# Altium schematic sheet 电源ARM_VRD240512MP-8W.SchDoc
size A4; DocumentNumber: 11; SheetNumber: 11; SheetTotal: 34
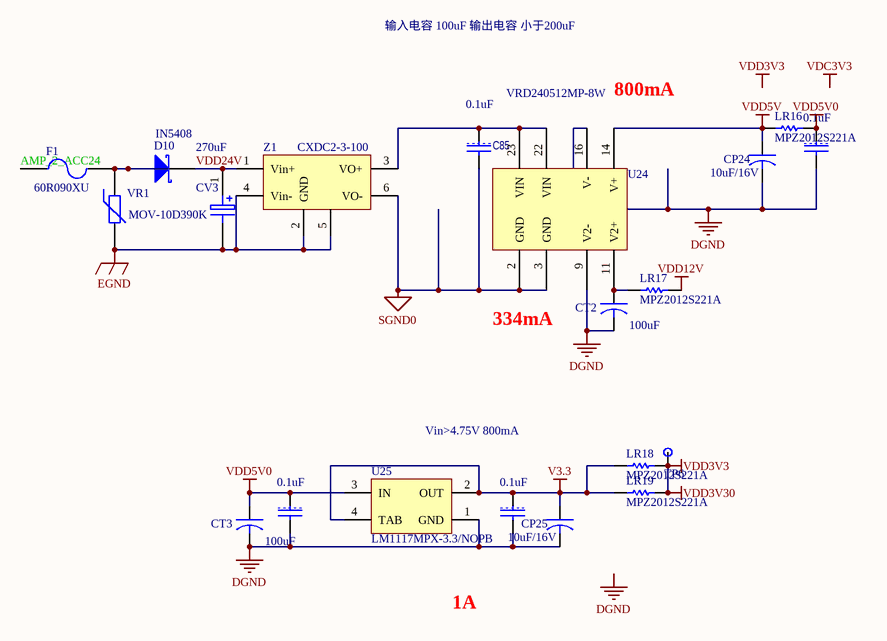
[diagram p0: 电源ARM_VRD240512MP-8W.SchDoc]

## Parts
C85  value 0.1uF  [1608[0603]C]  (hidden comment: C1608X7R1H104K)
C86  value 0.1uF  [1608[0603]C]  (hidden comment: C1608X7R1H104K)
C87  value 0.1uF  [1608[0603]C]  (hidden comment: C1608X7R1H104K)
C88  value 0.1uF  [1608[0603]C]  (hidden comment: C1608X7R1H104K)
CP24  10uF/16V  [3216[1206]CB]
CP25  10uF/16V  [3216[1206]CB]
CT2  value 100uF  [6032[2312]CC]  (hidden comment: TAJC107K016RNJ)
CT3  value 100uF  [6032[2312]CC]  (hidden comment: TAJC107K016RNJ)
CV3  value 270uF  [CAPPR5-10x20/H1.1]  (hidden comment: EEU-FM1H271)
D10  IN5408  [DO-214AB/SMC]
F1  60R090XU  [FUS-0.2]
LR16  MPZ2012S221A  [2012[0805]]
LR17  MPZ2012S221A  [2012[0805]]
LR18  MPZ2012S221A  [2012[0805]]
LR19  MPZ2012S221A  [2012[0805]]
TP6  TP  [TP]  (value not drawn)
U24  VRD240512MP-8W  [DIP-7(24)W]
U25  LM1117MPX-3.3/NOPB  [MP04A_N]
VR1  MOV-10D390K  [RAD-0.3]
Z1  CXDC2-3-100  [DIP-6(20)W]

## Nets
DGND: C86.2 C87.2 C88.2 CP24.2 CP25.2 CT2.2 CT3.2 U24.9(V2-) U24.16(V-) U25.1(GND)
EGND: CV3.2 VR1.2 Z1.2(GND) Z1.4(Vin-) Z1.5(GND)
SGND0: C85.2 U24.2(GND) U24.3(GND) Z1.6(VO-)
V3.3: C88.1 CP25.1 LR18.1 LR19.1 U25.2(OUT) U25.4(TAB)
VDD3V3: LR18.2 LR19.2 TP6.1(TestPoint)  [also labelled VDD3V30]
VDD5V: CP24.1 LR16.1 U24.14(V+)
VDD5V0: C86.1 C87.1 CT3.1 LR16.2 U25.3(IN)
VDD12V: LR17.2
AMP_2_ACC24: F1.1
VDD24V: CV3.1 D10.2(K) Z1.1(Vin+)
NetC85_1: C85.1 U24.22(VIN) U24.23(VIN) Z1.3(VO+)
NetCT2_1: CT2.1 LR17.1 U24.11(V2+)
NetD10_1: D10.1(A) F1.2 VR1.1

## Notes on the sheet
- 输入电容 100uF 输出电容 小于200uF
- 800mA
- 334mA
- Vin>4.75V 800mA
- 1A
- Labels drawn without touching a wire or pin: DGND, VDC3V3, VDD3V3

## Library data of the parts
C85-C88 = CAP: 多层陶瓷电容器MLCC - SMD/SMT 0603 0.1uF 50volts X7R 10%; Manufacturer: TDK; 产品: General Type MLCCs; 产品种类: Low & Medium Capacitance SMD Ceramic Chip Capacitors; 外壳代码 - in: 0603; 外壳代码 - mm: 1608; 封装 / 箱体: 0603 (1608 metric); 封装: Reel; 尺寸: 0.8 mm W x 1.6 mm L x 0.8 mm H; 工作温度范围: - 55 C to + 125 C; 标准包装数量: 4000; 电压额定值: 50 V; 电容-nF: 100 nF; 电容-pF: 100000 pF; 系列: C; Supplier 1: Mouser; Supplier Part Number 1: 810-C1608X7R1H104K; Manufacturer Part Number: C1608X7R1H104K; RoHS: RoHS Compliant; Description 1: 多层陶瓷电容器MLCC - SMD/SMT 0603 0.1uF 50volts X7R 10%; Category: 多层陶瓷电容器MLCC - SMD/SMT; Stock 1: 224604; Pricing 1: 1=0.160, 50=0.070, 100=0.036, 500=0.019, 1000=0.013, 4000=0.010, 8000=0.009, 12000=0.008, 20000=0.007 (USD); ComponentLink1URL: http://www.tdk.com/pdf/general_B11.pdf; ComponentLink1Description: http://www.tdk.com/pdf/general_B11.pdf; Minimum Order Quantity: 1; Reeling: True; RoHS - 贸泽: Y; 制造商: TDK; 容差: 10 %; 温度系数/代码: X7R; 电容: 0.1 uF; 端接类型: SMD/SMT
CP24 CP25 = CAPACITOR: Tantalum Capacitor; Compy: TAJ; name: TAJ-A-106-M-010-R
CT2 CT3 = CAPACITOR: 钽质电容器-固体SMD 16V 100uF 10%; Manufacturer: AVX; 尺寸: 3.2 mm W x 6 mm L; 高度: 2.8 mm; 工作温度范围: - 55 C to + 125 C; 封装 / 箱体: 2412 (6032 metric); 封装: Reel; 产品: Tantalum Solid Standard Grade - Other Various; 系列: TAJ; 端接类型: SMD/SMT; ESR: 1 Ohms; 漏泄电流: 16 uA; 外壳代码 - in: 2412; 外壳代码 - mm: 6032; 损耗因数 DF: 8; 制造商库存号: C Case; 产品种类: SMD Tantalum Capacitors; 标准包装数量: 500; Supplier 1: Mouser; Supplier Part Number 1: 581-TAJC107K016RNJ; Manufacturer Part Number: TAJC107K016RNJ; RoHS: RoHS Compliant; Description 1: 钽质电容器-固体SMD 16V 100uF 10%; Category: 钽质电容器-固体SMD; Stock 1: 40; Pricing 1: 1=1.50, 50=0.930, 100=0.720, 500=0.540, 1000=0.480 (USD); 电容: 100 uF; 容差: 10 %; 电压额定值: 16 V; 制造商: AVX; RoHS - 贸泽: Y; Minimum Order Quantity: 1; Reeling: True; ComponentLink1URL: http://www.avx.com/docs/Catalogs/taj.pdf; ComponentLink1Description: http://www.avx.com/docs/Catalogs/taj.pdf
CV3 = ELECTRO1: 插针 铝质电解电容器 - 带引线 270UF 50V ELECT FM RADIAL; Manufacturer: Panasonic Electronic Components; 工作温度范围: - 40 C to + 105 C; 封装: Bulk; 产品: Low Impedance Electrolytic Capacitors; 容差: 20 %; 外壳直径: 10 mm; 外壳长度: 20 mm; 损耗因数 DF: 0.1; 引线间隔: 5 mm; 加载寿命: 5000 hr; 制造商: Panasonic; 纹波电流: 1890 mA; 标准包装数量: 200; Supplier 1: Mouser; Supplier Part Number 1: 667-EEU-FM1H271; Manufacturer Part Number: EEU-FM1H271; RoHS: RoHS Compliant; Description 1: 铝质电解电容器 - 带引线 270UF 50V ELECT FM RADIAL; Category: 铝质电解电容器 - 带引线; Stock 1: 264; Pricing 1: 1=0.370, 25=0.334, 100=0.305, 250=0.281, 500=0.246, 1000=0.226, 2000=0.216, 5000=0.200 (USD); 电容: 270 uF; 系列: FM; 端接类型: Radial; 电压额定值: 50 V; RoHS - 贸泽: Y; Minimum Order Quantity: 1; Reeling: False; ComponentLink1URL: http://www.mouser.com/ds/2/315/ABA0000CE108-5973.pdf; ComponentLink1Description: http://www.mouser.com/ds/2/315/ABA0000CE108-5973.pdf
D10 = D Schottky: 肖特基二极管与整流器 3.0 Amp 60 Volt; Manufacturer: Vishay Semiconductors; Manufacturer Part Number: SS36-E3/57T; 配置: Single; 工作温度范围: - 55 C to + 150 C; 封装 / 箱体: SMC (DO-214AB); 封装: Reel; 产品: Schottky Rectifiers; 正向连续电流: 3 A; 最大浪涌电流: 100 A; 安装风格: SMD/SMT; 正向电压下降: 0.75 V; 制造商: Vishay; 最大反向漏泄电流: 500 uA; 峰值反向电压: 60 V; 标准包装数量: 850; Supplier 1: Mouser; Supplier Part Number 1: 625-SS36-E3; RoHS: RoHS Compliant By Exemption; Description 1: 肖特基二极管与整流器 3.0 Amp 60 Volt; Category: 肖特基二极管与整流器; Stock 1: 481; Pricing 1: 1=0.280, 10=0.250, 100=0.188, 250=0.154, 500=0.144, 850=0.144, 1000=0.139, 2000=0.131 (USD); 产品种类: Schottky Rectifiers; RoHS - 贸泽: E; Minimum Order Quantity: 1; Reeling: True; ComponentLink1URL: http://www.mouser.com/ds/2/427/88751-106389.pdf; ComponentLink1Description: http://www.mouser.com/ds/2/427/88751-106389.pdf
F1 = Fuse 2: 插针 可复位保险丝 60V POLYFUSE .100A RADIAL LEADS; Manufacturer: Littelfuse; Manufacturer Part Number: 60R010XU; 电流额定值: 40 A; 尺寸: 12.7 mm L x 3.1 mm  H x 7.4 mm D; 工作温度范围: - 40 C to + 85 C; 封装: Bulk; 电阻: 7.5 Ohms; 系列: 60R; 类型: PolyFuse Resettable PTC; 保持电流: 0.1 A; 最大电压: 60 VDC; 安装风格: Through Hole; 跳闸电流: 0.2 A; 引线间隔: 5.1 mm; 产品种类: Resettable PTCs; 标准包装数量: 500; Supplier 1: Mouser; Supplier Part Number 1: 576-60R010XU; RoHS: RoHS Compliant; Description 1: 可复位保险丝 60V POLYFUSE .100A RADIAL LEADS; Category: 可复位保险丝; Stock 1: 3959; Pricing 1: 1=0.410, 10=0.341, 100=0.283, 250=0.258, 500=0.219, 1000=0.193, 2500=0.177, 5000=0.174, 10000=0.161 (USD); 端接类型: Radial; 电流额定值（最大值）: 40 A; 制造商: Littelfuse; 最大直流电压: 60 V; RoHS - 贸泽: Y; Minimum Order Quantity: 1; Reeling: False; ComponentLink1URL: http://www.mouser.com/ds/2/240/Littelfuse_60R-61724.pdf; ComponentLink1Description: http://www.mouser.com/ds/2/240/Littelfuse_60R-61724.pdf
LR16-LR19 = Res Semi: 电磁干扰滤波珠子、扼流圈和阵列 Ferrite Chip Beads; Manufacturer: TDK; 阻抗: 220 Ohms; 最大直流电流: 3 A; 最大直流电阻: 0.04 Ohms; 工作温度范围: - 55 C to + 125 C; 封装 / 箱体: 2012; 封装: Reel; 端接类型: SMD/SMT; 容差: 25 %; 产品种类: Ferrite Beads; 标准包装数量: 4000; Supplier 1: Mouser; Supplier Part Number 1: 810-MPZ2012S221A; Manufacturer Part Number: MPZ2012S221A; RoHS: RoHS Compliant; Description 1: 电磁干扰滤波珠子、扼流圈和阵列 Ferrite Chip Beads; Category: 电磁干扰滤波珠子、扼流圈和阵列; Stock 1: 26540; Pricing 1: 1=0.070, 50=0.060, 100=0.053, 500=0.040, 1000=0.035, 4000=0.031, 8000=0.029, 12000=0.025 (USD); 制造商: TDK; RoHS - 贸泽: Y; Minimum Order Quantity: 1; Reeling: True; ComponentLink1URL: http://www.mouser.com/ds/2/400/e9413_mpz-24582.pdf; ComponentLink1Description: http://www.mouser.com/ds/2/400/e9413_mpz-24582.pdf
TP6 = Test Point
U24 = VRD240512MP-8W: 插针VRD240512MP-8W 2:1 1500V 82%
U25 = LM1117MPX-3.3/NOPB: 800mA Low-Dropout Linear Regulator, 4-pin SOT-223, Pb-Free; Manufacturer: National Semiconductor; PackageTopMarking: XYTT*N05A; PowerWise: N; CompType: LDO IC; Published: 1-Mar-2010; DatasheetVersion: Apr-2006; PackageVersion: revB, Apr-2003; PackageReference: MP04A; Publisher: Altium Limited; PackageDescription: Molded SOT-223, 6.50 x 3.56 x 1.6mm Body, 4 Lead, 2.3mm Pitch; Supplier 1: Digi-Key; Supplier Part Number 1: LM1117MPX-3.3TR-ND; Supplier 2: Digi-Key; Supplier Part Number 2: LM1117MPX-3.3CT-ND; Supplier 3: Digi-Key; Supplier Part Number 3: LM1117MPX-3.3DKR-ND; PartNumber: LM1117MPX-3.3/NOPB; RoHS: Y; PinCount: 4; Code_JEDEC: TO-261-AA; Code_IPC: SOT223-4; ComponentLink1Description: LM1117 Datasheet; ComponentLink1URL: http://www.national.com/ds/LM/LM1117.pdf; ComponentLink2Description: LM1117 Web Page; ComponentLink2URL: http://www.national.com/pf/LM/LM1117.html; ComponentLink3Description: MP04A Package Page; ComponentLink3URL: http://www.national.com/packaging/folders/mp04a.html
VR1 = Res Varistor: 插针 压敏电阻 500A 39volts 10%; Manufacturer: Bourns; Description 1: 压敏电阻 2400pF 39volts 10%; 电容: 2400 pF; 钳位电压: 77 V; 直径: 10 mm; 尺寸: 12.5 mm Dia. x 7.2 mm W; 安装: Radial; 工作温度范围: - 40 C to + 85 C; 封装: Bulk; 浪涌能量额定值: 4.6 J; 电压额定值 DC: 43 V; 外壳直径: 12.5 mm; 外壳宽度: 7.2 mm; Supplier 1: Mouser; Supplier Part Number 1: 652-MOV-10D390K; Manufacturer Part Number: MOV-10D390K; RoHS: RoHS Compliant; Category: 压敏电阻; Stock 1: 13078; Pricing 1: 1=0.200, 10=0.165, 100=0.154, 250=0.137, 500=0.114, 1000=0.108, 5000=0.077, 10000=0.076 (USD); 容差: 10 %; 峰值浪涌电流: 500 A; 制造商: Bourns; RoHS - 贸泽: Y; Minimum Order Quantity: 1; Reeling: False; ComponentLink1URL: http://www.bourns.com/data/global/pdfs/MOV10D.pdf; ComponentLink1Description: http://www.bourns.com/data/global/pdfs/MOV10D.pdf; Supplier 2: Mouser; Supplier Part Number 2: 667-ERZ-V10D390
Z1 = CXDB: 插针 Filter; 公司: 中北创新